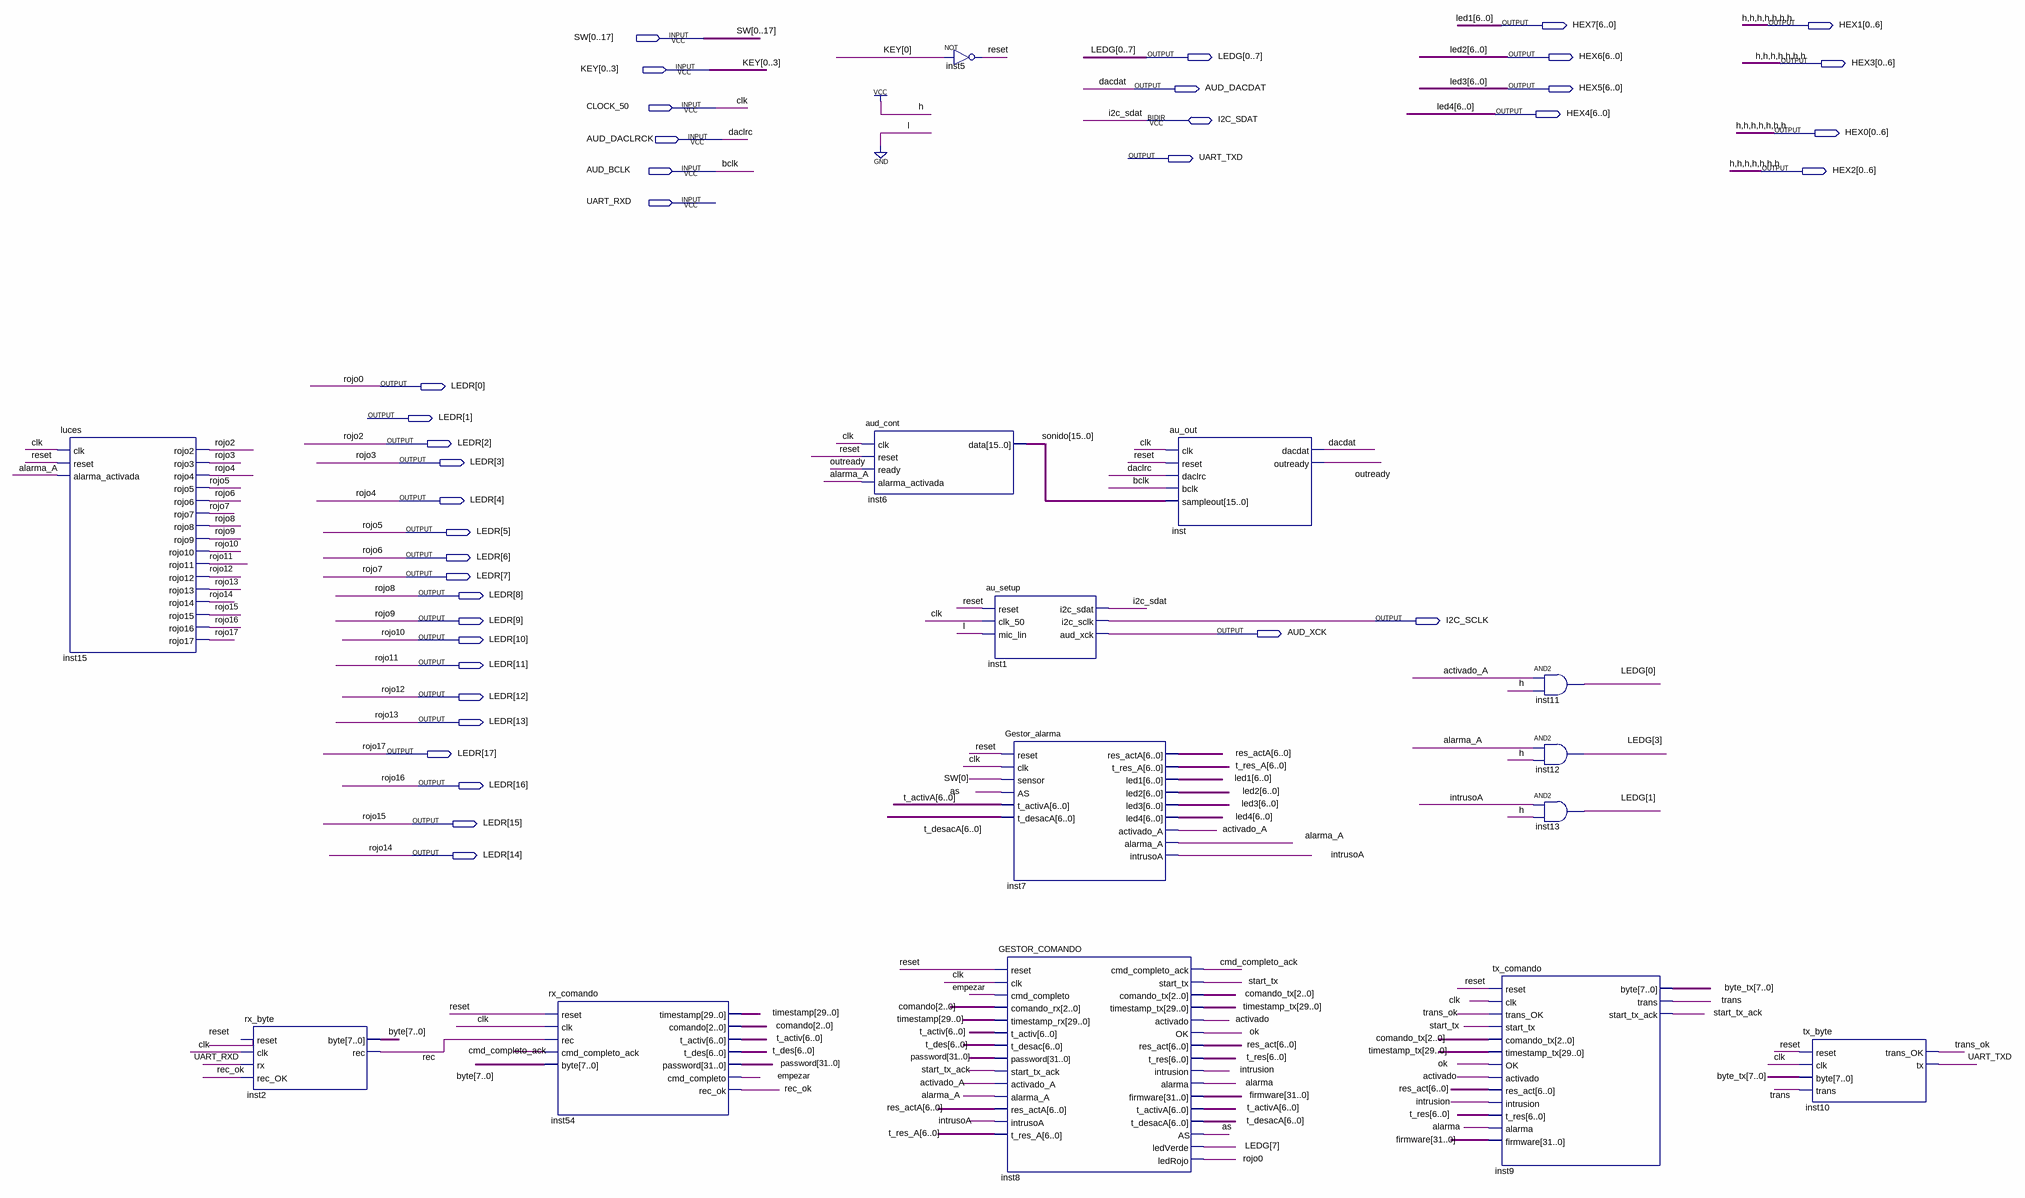
[diagram p0: schematic sheet]
// Quartus schematic test_proyecto.bdf as structural Verilog: 14 symbols, 38 pins
module test_proyecto (
  input  [0:17] SW,
  input  [0:3] KEY,
  input  CLOCK_50,
  input  AUD_DACLRCK,
  input  AUD_BCLK,
  input  UART_RXD,
  inout  I2C_SDAT,
  output [6:0] HEX7,
  output [0:6] HEX1,
  output [0:7] LEDG,
  output [6:0] HEX6,
  output [0:6] HEX3,
  output AUD_DACDAT,
  output [6:0] HEX5,
  output [6:0] HEX4,
  output [0:6] HEX0,
  output UART_TXD,
  output [0:6] HEX2,
  output [17:0] LEDR,
  output I2C_SCLK,
  output AUD_XCK
);

  wire activado, activado_A, alarma, alarma_A, as, cmd_completo_ack, empezar, intrusion, intrusoA, ok,
       outready, rec, rec_ok, reset, start_tx, start_tx_ack, trans, trans_ok;
  wire [2:0] comando, comando_tx;
  wire [6:0] res_act, res_actA, t_activ, t_activA, t_des, t_desacA, t_res, t_res_A;
  wire [7:0] \byte , byte_tx;
  wire [15:0] sonido;
  wire [29:0] timestamp, timestamp_tx;
  wire [31:0] firmware, password;

  luces inst15 (
    .clk(CLOCK_50), .reset(reset), .alarma_activada(alarma_A), .rojo2(LEDR[2]), .rojo3(LEDR[3]),
    .rojo4(LEDR[4]), .rojo5(LEDR[5]), .rojo6(LEDR[6]), .rojo7(LEDR[7]), .rojo8(LEDR[8]), .rojo9(LEDR[9]),
    .rojo10(LEDR[10]), .rojo11(LEDR[11]), .rojo12(LEDR[12]), .rojo13(LEDR[13]), .rojo14(LEDR[14]),
    .rojo15(LEDR[15]), .rojo16(LEDR[16]), .rojo17(LEDR[17]));
  rx_byte inst2 (.reset(reset), .clk(CLOCK_50), .rx(UART_RXD), .rec_OK(rec_ok), .\byte (\byte ), .rec(rec));
  rx_comando inst54 (
    .reset(reset), .clk(CLOCK_50), .rec(rec), .cmd_completo_ack(cmd_completo_ack), .\byte (\byte ),
    .timestamp(timestamp), .comando(comando), .t_activ(t_activ), .t_des(t_des), .password(password),
    .cmd_completo(empezar), .rec_ok(rec_ok));
  aud_cont inst6 (.clk(CLOCK_50), .reset(reset), .ready(outready), .alarma_activada(alarma_A), .data(sonido));
  not inst5 (reset, KEY[0]);
  au_setup inst1 (
    .reset(reset), .clk_50(CLOCK_50), .mic_lin(1'b0), .i2c_sclk(I2C_SCLK), .aud_xck(AUD_XCK),
    .i2c_sdat(I2C_SDAT));
  Gestor_alarma inst7 (
    .reset(reset), .clk(CLOCK_50), .sensor(SW[0]), .AS(as), .t_activA(t_activA), .t_desacA(t_desacA),
    .res_actA(res_actA), .t_res_A(t_res_A), .led1(HEX7), .led2(HEX6), .led3(HEX5), .led4(HEX4),
    .activado_A(activado_A), .alarma_A(alarma_A), .intrusoA(intrusoA));
  GESTOR_COMANDO inst8 (
    .reset(reset), .clk(CLOCK_50), .cmd_completo(empezar), .comando_rx(comando), .timestamp_rx(timestamp),
    .t_activ(t_activ), .t_desac(t_des), .password(password), .start_tx_ack(start_tx_ack),
    .activado_A(activado_A), .alarma_A(alarma_A), .res_actA(res_actA), .intrusoA(intrusoA),
    .t_res_A(t_res_A), .cmd_completo_ack(cmd_completo_ack), .start_tx(start_tx), .comando_tx(comando_tx),
    .timestamp_tx(timestamp_tx), .activado(activado), .OK(ok), .res_act(res_act), .t_res(t_res),
    .intrusion(intrusion), .alarma(alarma), .firmware(firmware), .t_activA(t_activA), .t_desacA(t_desacA),
    .AS(as), .ledVerde(LEDG[7]), .ledRojo(LEDR[0]));
  au_out inst (
    .clk(CLOCK_50), .reset(reset), .daclrc(AUD_DACLRCK), .bclk(AUD_BCLK), .sampleout(sonido),
    .dacdat(AUD_DACDAT), .outready(outready));
  tx_comando inst9 (
    .reset(reset), .clk(CLOCK_50), .trans_OK(trans_ok), .start_tx(start_tx), .comando_tx(comando_tx),
    .timestamp_tx(timestamp_tx), .OK(ok), .activado(activado), .res_act(res_act), .intrusion(intrusion),
    .t_res(t_res), .alarma(alarma), .firmware(firmware), .\byte (byte_tx), .trans(trans),
    .start_tx_ack(start_tx_ack));
  and inst11 (LEDG[0], activado_A, 1'b1);
  and inst12 (LEDG[3], alarma_A, 1'b1);
  and inst13 (LEDG[1], intrusoA, 1'b1);
  tx_byte inst10 (.reset(reset), .clk(CLOCK_50), .\byte (byte_tx), .trans(trans), .trans_OK(trans_ok), .tx(UART_TXD));

  assign HEX0 = {7{1'b1}};
  assign HEX1 = {7{1'b1}};
  assign HEX2 = {7{1'b1}};
  assign HEX3 = {7{1'b1}};

  // Other names for the same wires on the sheet: bclk = AUD_BCLK; clk = CLOCK_50; dacdat = AUD_DACDAT;
  //   daclrc = AUD_DACLRCK; led1[6:0] = HEX7; led2[6:0] = HEX6; led3[6:0] = HEX5; led4[6:0] = HEX4; rojo0 = LEDR[0];
  //   rojo2 = LEDR[2]; rojo3 = LEDR[3]; rojo4 = LEDR[4]; rojo5 = LEDR[5]; rojo6 = LEDR[6]; rojo7 = LEDR[7];
  //   rojo8 = LEDR[8]; rojo9 = LEDR[9]; rojo10 = LEDR[10]; rojo11 = LEDR[11]; rojo12 = LEDR[12]; rojo13 = LEDR[13];
  //   rojo14 = LEDR[14]; rojo15 = LEDR[15]; rojo16 = LEDR[16]; rojo17 = LEDR[17]
endmodule
